# Altium project HAB-Altitude-Dynamics-Control-Card.PrjPcb (part 2 of 4)

## Sheet Controllers.SchDoc: Payload Card Output Control
size A3; Revision: 1A; SheetNumber: 3; SheetTotal: 7; Organization: Brickworks; Address1: Matthew Glazer; Address2: Design Engineer
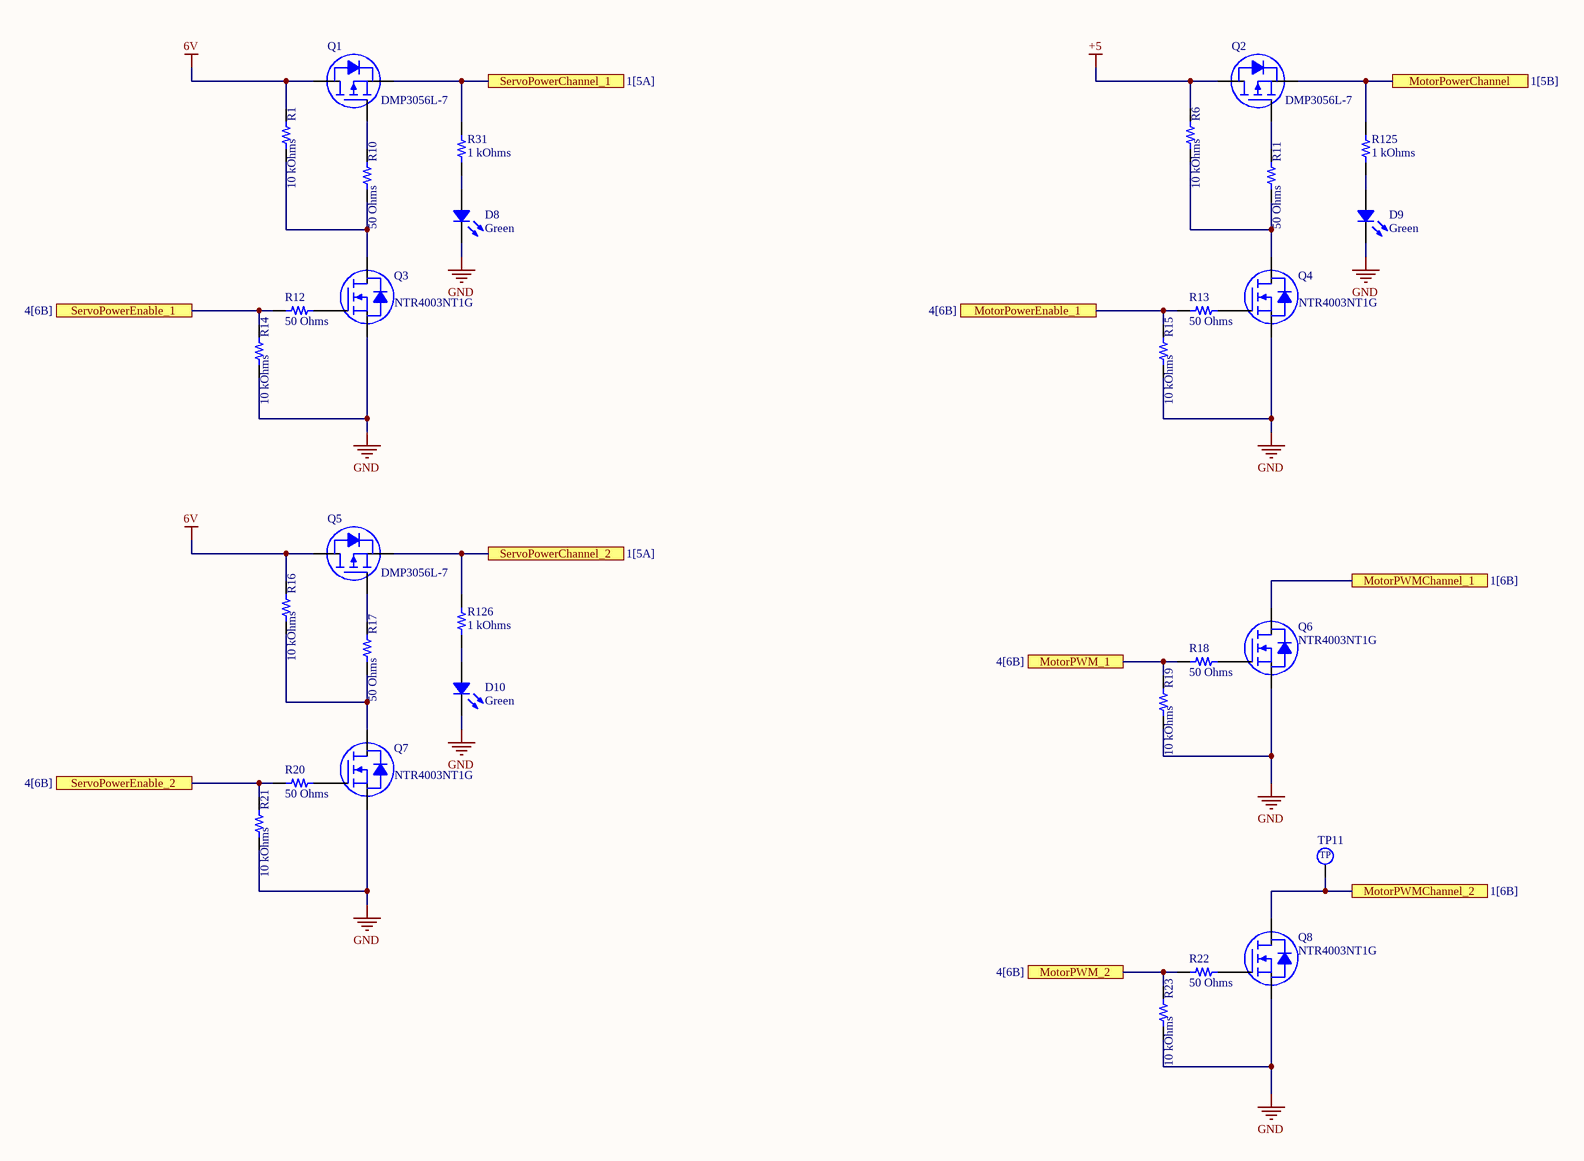
[diagram p2: Controllers.SchDoc]

### Parts
D8  Green  [LED 0603_1608 GREEN]
D9  Green  [LED 0603_1608 GREEN]
D10  Green  [LED 0603_1608 GREEN]
Q1  DMP3056L-7  [DIODES SOT-23-3]
Q2  DMP3056L-7  [DIODES SOT-23-3]
Q3  NTR4003NT1G  [ON SEMI SOT-23-3]
Q4  NTR4003NT1G  [ON SEMI SOT-23-3]
Q5  DMP3056L-7  [DIODES SOT-23-3]
Q6  NTR4003NT1G  [ON SEMI SOT-23-3]
Q7  NTR4003NT1G  [ON SEMI SOT-23-3]
Q8  NTR4003NT1G  [ON SEMI SOT-23-3]
R1  10 kOhms  [RES 0603_1608]
R6  10 kOhms  [RES 0603_1608]
R10  50 Ohms  [RES 0603_1608]
R11  50 Ohms  [RES 0603_1608]
R12  50 Ohms  [RES 0603_1608]
R13  50 Ohms  [RES 0603_1608]
R14  10 kOhms  [RES 0603_1608]
R15  10 kOhms  [RES 0603_1608]
R16  10 kOhms  [RES 0603_1608]
R17  50 Ohms  [RES 0603_1608]
R18  50 Ohms  [RES 0603_1608]
R19  10 kOhms  [RES 0603_1608]
R20  50 Ohms  [RES 0603_1608]
R21  10 kOhms  [RES 0603_1608]
R22  50 Ohms  [RES 0603_1608]
R23  10 kOhms  [RES 0603_1608]
R31  1 kOhms  [RES 0603_1608]
R125  1 kOhms  [RES 0603_1608]
R126  1 kOhms  [RES 0603_1608]
TP11  2.5mm_SMD_TestPoint  [2.5mm TestPoint]  (value not drawn)

### Ports
MotorPowerChannel (see 1[5B]), MotorPowerEnable_1 (see 4[6B]), MotorPWM_1 (see 4[6B]), MotorPWM_2 (see 4[6B]), MotorPWMChannel_1 (see 1[6B]), MotorPWMChannel_2 (see 1[6B]), ServoPowerChannel_1 (see 1[5A]), ServoPowerChannel_2 (see 1[5A]), ServoPowerEnable_1 (see 4[6B]), ServoPowerEnable_2 (see 4[6B])

### Nets
6V: Q1.3(D) Q5.3(D) R1.2 R16.2
+5: Q2.3(D) R6.2
GND: D8.2 D9.2 D10.2 Q3.2(S) Q4.2(S) Q6.2(S) Q7.2(S) Q8.2(S) R14.1 R15.1 R19.1 R21.1 R23.1
NetC1_2: Q1.2(S) R31.2 ; port ServoPowerChannel_1
NetC6_2: Q5.2(S) R126.2 ; port ServoPowerChannel_2
NetC8_2: Q2.2(S) R125.2 ; port MotorPowerChannel
NetD8_1: D8.1 R31.1
NetD9_1: D9.1 R125.1
NetD10_1: D10.1 R126.1
NetJ5_1: Q6.3(D) ; port MotorPWMChannel_1
NetJ6_1: Q8.3(D) TP11.1 ; port MotorPWMChannel_2
NetQ1_1: Q1.1(G) R10.2
NetQ2_1: Q2.1(G) R11.2
NetQ3_1: Q3.1(G) R12.1
NetQ3_3: Q3.3(D) R1.1 R10.1
NetQ4_1: Q4.1(G) R13.1
NetQ4_3: Q4.3(D) R6.1 R11.1
NetQ5_1: Q5.1(G) R17.2
NetQ6_1: Q6.1(G) R18.1
NetQ7_1: Q7.1(G) R20.1
NetQ7_3: Q7.3(D) R16.1 R17.1
NetQ8_1: Q8.1(G) R22.1
NetR12_2: R12.2 R14.2 ; port ServoPowerEnable_1
NetR13_2: R13.2 R15.2 ; port MotorPowerEnable_1
NetR18_2: R18.2 R19.2 ; port MotorPWM_1
NetR20_2: R20.2 R21.2 ; port ServoPowerEnable_2
NetR22_2: R22.2 R23.2 ; port MotorPWM_2

### Notes on the sheet
- Title
- Size:
- Date:
- A3
- Number:
- Time:
- Revision:
- Sheet
- of
- File:
- (in symbol 2.5mm_SMD_TestPoint) TP

### Library data of the parts
D8-D10 = LTST-C193KGKT-5A: LED GREEN CLEAR CHIP SMD; Manufacturer: Lite-On Inc.; Configuration: Standard; Current - Test: 5mA; Lens Color: Colorless; Lens Size: 1.15mm x 0.80mm; Lens Style: Rectangle with Flat Top; Millicandela Rating: 16.25mcd; Viewing Angle: 130°; Voltage - Forward (Vf) (Typ): 2V; Wavelength - Dominant: 572nm; Wavelength - Peak: 574nm; Part Number: LTST-C193KGKT-5A; Color: Green; ComponentLink1Description: Datasheet; ComponentLink1URL: http://optoelectronics.liteon.com/upload/download/DS22-2007-0094/LTST-C193KGKT-5A.PDF; ComponentLink2Description: DigiKey Link; ComponentLink2URL: http://digikey.com/product-detail/en/lite-on-inc/LTST-C193KGKT-5A/160-1828-1-ND/2356247; Device Package: 0603 (1608 Metric); Height (Max): 0.45mm; LastUpdated: 9/2/2020 1:20:41 AM; Lens Transparency: Clear; Lifecycle Status: Active; Minimum Order: 1; Mounting Type: Surface Mount; Package / Case: 0603 (1608 Metric); Packaging: TapeAndReel; PartId: 694; Part Status: Active; Price: 0.06; Series: -; Size / Dimension: 1.60mm L x 0.80mm W; Supplier 1: DigiKey; Supplier Part Number 1: 160-1828-1-ND; Supplier Device Package: Chip LED; Value: Green
Q1 Q2 Q5 = DMP3056L-7: MOSFET P-CH 30V 4.3A SOT23; Manufacturer: Diodes Incorporated; Current - Continuous Drain (Id) @ 25°C: 4.3A (Ta); Drive Voltage (Max Rds On,  Min Rds On): 4.5V, 10V; FET Type: P-Channel; Gate Charge (Qg) (Max) @ Vgs: 11.8nC @ 10V; Input Capacitance (Ciss) (Max) @ Vds: 642pF @ 25V; Power Dissipation (Max): 1.38W (Ta); Rds On (Max) @ Id, Vgs: 50mOhm @ 6A, 10V; Vgs (Max): ±25V; Vgs(th) (Max) @ Id: 2.1V @ 250µA; Part Number: DMP3056L-7; ComponentLink1Description: Datasheet; ComponentLink1URL: https://www.diodes.com/assets/Datasheets/DMP3056L.pdf; ComponentLink2Description: DigiKey Link; ComponentLink2URL: http://digikey.com/product-detail/en/diodes-incorporated/DMP3056L-7/DMP3056L-7DICT-ND/5126873; Drain to Source Voltage (Vdss): 30V; LastUpdated: 9/2/2020 1:25:04 AM; Lifecycle Status: Active; Minimum Order: 1; Mounting Type: Surface Mount; Operating Temperature: -55°C ~ 150°C (TJ); Package / Case: TO-236-3, SC-59, SOT-23-3; Packaging: TapeAndReel; Part Status: Active; Price: 0.11; Series: -; Supplier 1: DigiKey; Supplier Part Number 1: DMP3056L-7DICT-ND; Supplier Device Package: SOT-23; Technology: MOSFET (Metal Oxide)
Q3 Q4 Q6-Q8 = NTR4003NT1G: MOSFET N-CH 30V 500MA SOT-23; Manufacturer: ON Semiconductor; Current - Continuous Drain (Id) @ 25°C: 500mA (Ta); Drive Voltage (Max Rds On,  Min Rds On): 2.5V, 4V; FET Type: N-Channel; Gate Charge (Qg) (Max) @ Vgs: 1.15nC @ 5V; Input Capacitance (Ciss) (Max) @ Vds: 21pF @ 5V; Power Dissipation (Max): 690mW (Ta); Rds On (Max) @ Id, Vgs: 1.5Ohm @ 10mA, 4V; Vgs (Max): ±20V; Vgs(th) (Max) @ Id: 1.4V @ 250µA; Part Number: NTR4003NT1G; ComponentLink1Description: Datasheet; ComponentLink1URL: http://www.onsemi.com/pub/Collateral/NTR4003N-D.PDF; ComponentLink2Description: DigiKey Link; ComponentLink2URL: http://digikey.com/product-detail/en/on-semiconductor/NTR4003NT1G/NTR4003NT1GOSCT-ND/1967270; Drain to Source Voltage (Vdss): 30V; LastUpdated: 9/2/2020 1:25:08 AM; Lifecycle Status: Active; Minimum Order: 1; Mounting Type: Surface Mount; Operating Temperature: -55°C ~ 150°C (TJ); Package / Case: TO-236-3, SC-59, SOT-23-3; Packaging: TapeAndReel; Part Status: Active; Price: 0.05; Series: -; Supplier 1: DigiKey; Supplier Part Number 1: NTR4003NT1GOSCT-ND; Supplier Device Package: SOT-23-3 (TO-236); Technology: MOSFET (Metal Oxide)
R1 R6 R14-R16 R19 R21 R23 = RMCF0603JT10K0: RES 10K OHM 5% 1/10W 0603; Manufacturer: Stackpole Electronics Inc; Power (Watts): 0.1W, 1/10W; Temperature Coefficient: ±200ppm/°C; Part Number: RMCF0603JT10K0; Value: 10 kOhms; ComponentLink1Description: Datasheet; ComponentLink1URL: https://www.seielect.com/catalog/sei-packaging.pdf; ComponentLink2Description: DigiKey Link; ComponentLink2URL: http://digikey.com/product-detail/en/stackpole-electronics-inc/RMCF0603JT10K0/RMCF0603JT10K0CT-ND/1943191; Composition: Thick Film; Device Package: 0603 (1608 Metric); Features: Automotive AEC-Q200; Height - Seated (Max): 0.022" (0.55mm); LastUpdated: 8/30/2020 8:48:45 PM; Lifecycle Status: Active; Minimum Order: 1; Number of Terminations: 2; Operating Temperature: -55°C ~ 155°C; Package / Case: 0603 (1608 Metric); Packaging: CutTape; PartId: 25659; Part Status: Active; Price: 0.10; Ratings: AEC-Q200; Resistance: 10 kOhms; Series: RMCF; Size / Dimension: 0.061" L x 0.031" W (1.55mm x 0.80mm); Supplier 1: DigiKey; Supplier Part Number 1: RMCF0603JT10K0CT-ND; Supplier Device Package: 0603; Tolerance: ±5%
R10-R13 R17 R18 R20 R22 = CRCW060350R0FKEA: RES SMD 50 OHM 1% 1/10W 0603; Manufacturer: Vishay Dale; Power (Watts): 0.1W, 1/10W; Temperature Coefficient: ±100ppm/°C; Part Number: CRCW060350R0FKEA; Value: 50 Ohms; ComponentLink1Description: Datasheet; ComponentLink1URL: http://www.vishay.com/docs/20035/dcrcwe3.pdf; ComponentLink2Description: DigiKey Link; ComponentLink2URL: http://digikey.com/product-detail/en/vishay-dale/CRCW060350R0FKEA/541-3318-1-ND/6684924; Composition: Thick Film; Device Package: 0603 (1608 Metric); Features: Automotive AEC-Q200; Height - Seated (Max): 0.020" (0.50mm); LastUpdated: 9/2/2020 1:09:40 AM; Lifecycle Status: Active; Minimum Order: 1; Number of Terminations: 2; Operating Temperature: -55°C ~ 155°C; Package / Case: 0603 (1608 Metric); Packaging: CutTape; PartId: 23780; Part Status: Active; Price: 0.10; Ratings: AEC-Q200; Resistance: 50 Ohms; Series: CRCW; Size / Dimension: 0.061" L x 0.033" W (1.55mm x 0.85mm); Supplier 1: DigiKey; Supplier Part Number 1: 541-3318-1-ND; Supplier Device Package: 0603; Tolerance: ±1%
R31 R125 R126 = RNCP0603FTD1K00: RES 1K OHM 1% 1/8W 0603; Manufacturer: Stackpole Electronics Inc; Power (Watts): 0.125W, 1/8W; Temperature Coefficient: ±100ppm/°C; Part Number: RNCP0603FTD1K00; Value: 1 kOhms; ComponentLink1Description: Datasheet; ComponentLink1URL: https://www.seielect.com/catalog/sei-rncp.pdf; ComponentLink2Description: DigiKey Link; ComponentLink2URL: http://digikey.com/product-detail/en/stackpole-electronics-inc/RNCP0603FTD1K00/RNCP0603FTD1K00CT-ND/2240445; Composition: Thin Film; Device Package: 0603 (1608 Metric); Features: Anti-Sulfur, Moisture Resistant; Height - Seated (Max): 0.020" (0.50mm); LastUpdated: 9/2/2020 1:10:23 AM; Lifecycle Status: Active; Minimum Order: 1; Number of Terminations: 2; Operating Temperature: -55°C ~ 155°C; Package / Case: 0603 (1608 Metric); Packaging: TapeAndReel; PartId: 5694; Part Status: Active; Price: 0.01; Resistance: 1 kOhms; Series: RNCP; Size / Dimension: 0.059" L x 0.031" W (1.50mm x 0.80mm); Supplier 1: DigiKey; Supplier Part Number 1: RNCP0603FTD1K00CT-ND; Supplier Device Package: 0603; Tolerance: ±1%

## Sheet Microcontroller.SchDoc: Payload Card Microcontroller
size A2; Revision: 1A; SheetNumber: 4; SheetTotal: 7; Organization: Brickworks; Address1: Matthew Glazer; Address2: Design Engineer
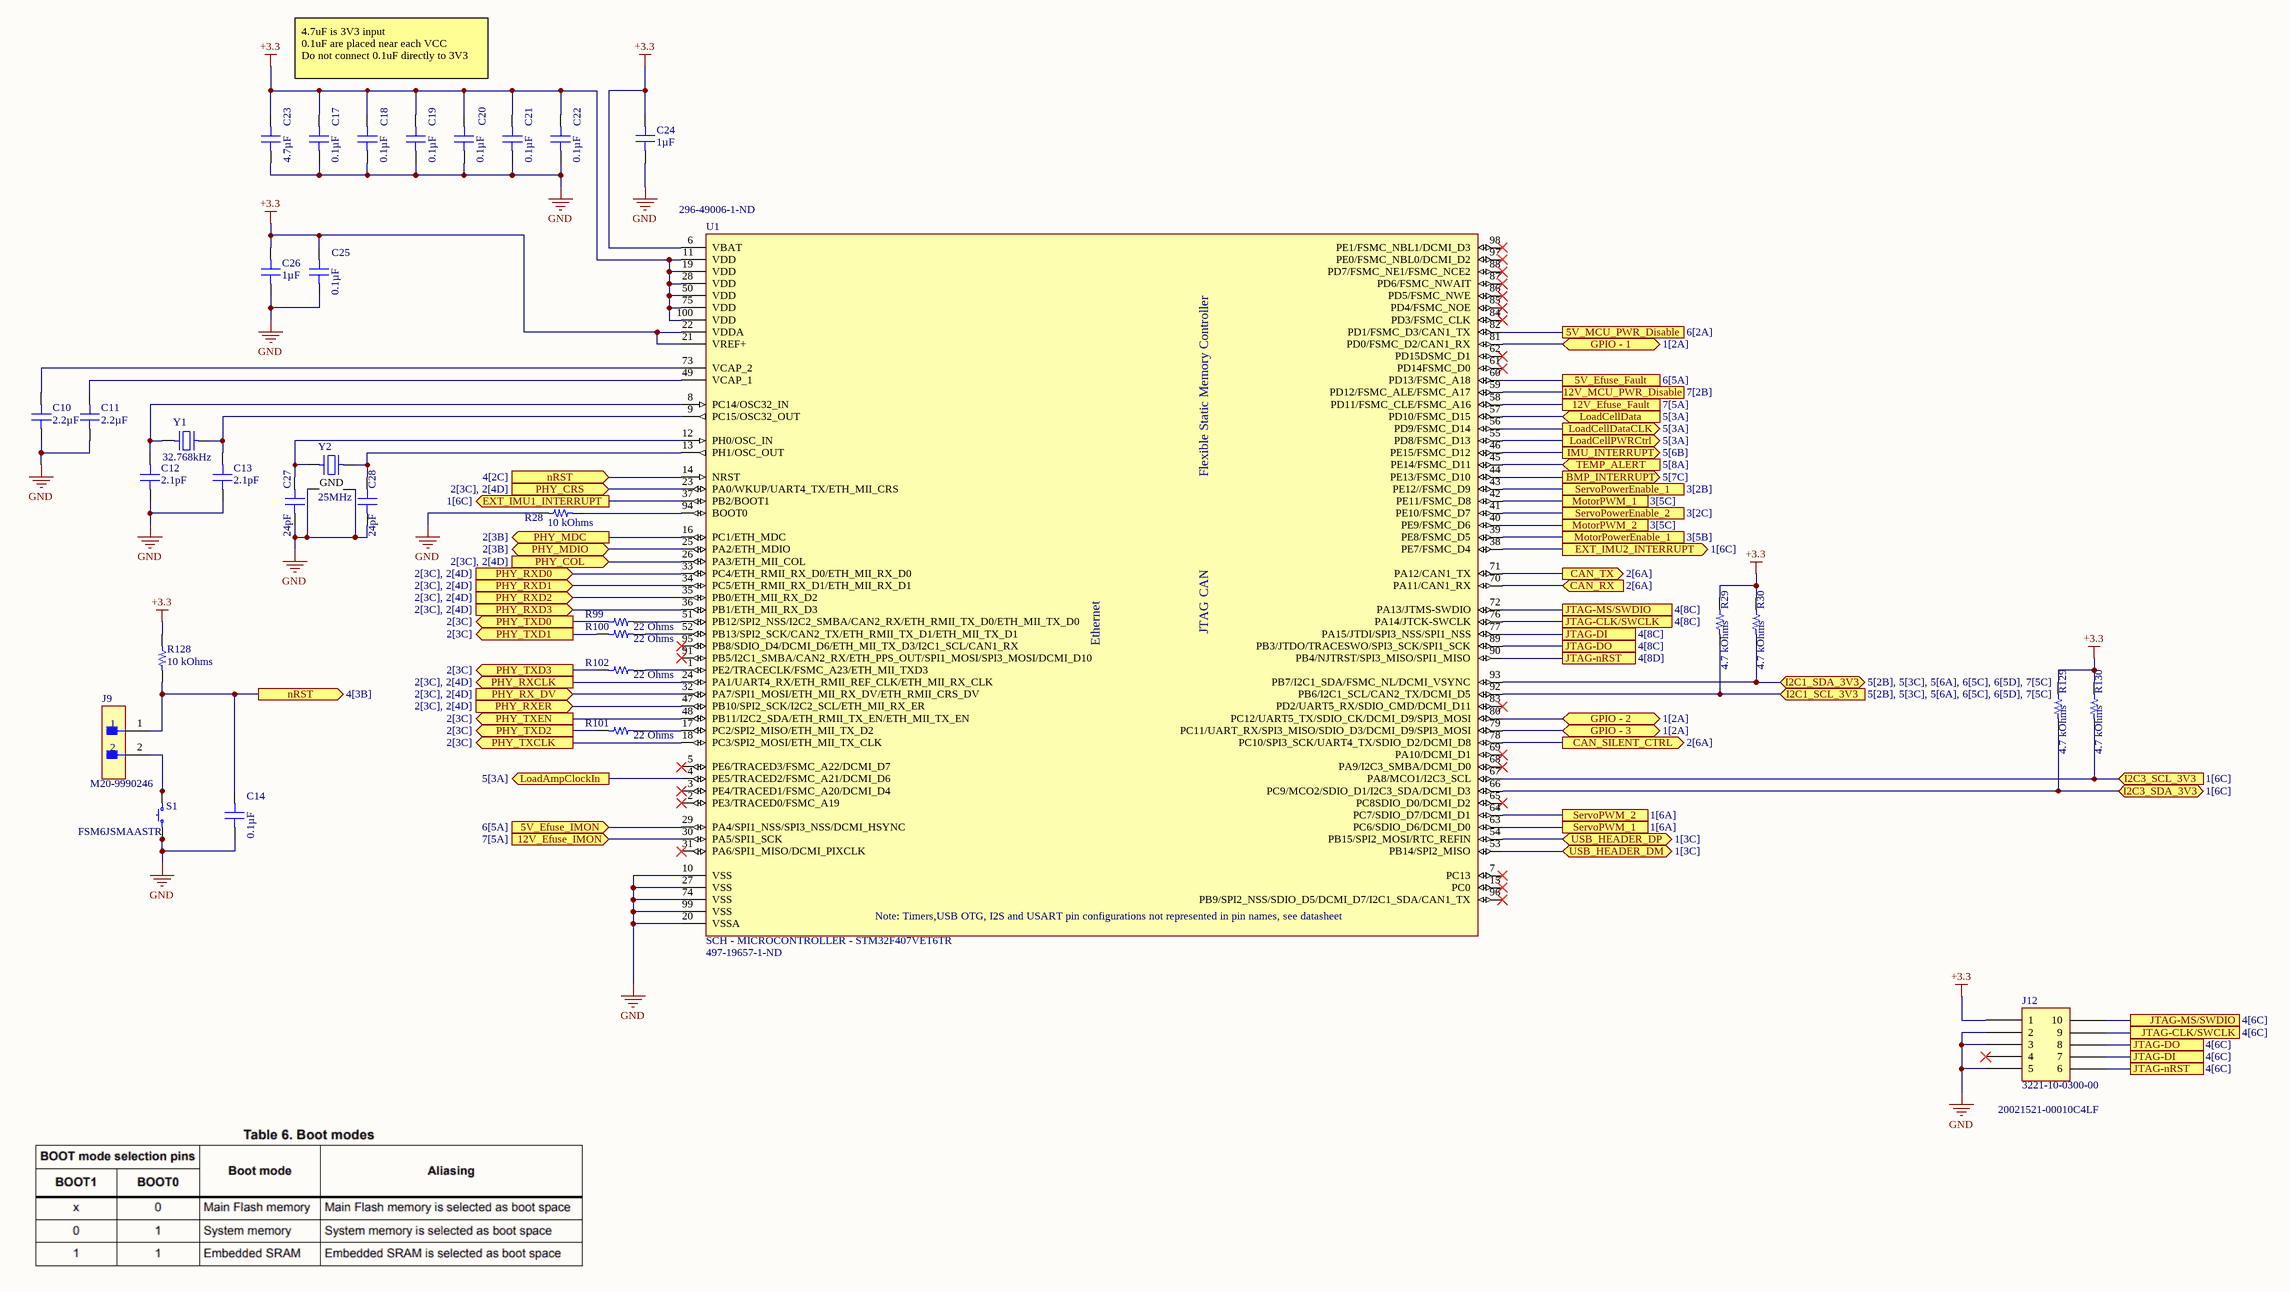
[diagram p3: Microcontroller.SchDoc]

### Parts
C10  2.2µF  [CAP 0603_1608]
C11  2.2µF  [CAP 0603_1608]
C12  2.1pF  [CAP 0603_1608]
C13  2.1pF  [CAP 0603_1608]
C14  0.1µF  [CAP 0603_1608]
C17  0.1µF  [CAP 0603_1608]
C18  0.1µF  [CAP 0603_1608]
C19  0.1µF  [CAP 0603_1608]
C20  0.1µF  [CAP 0603_1608]
C21  0.1µF  [CAP 0603_1608]
C22  0.1µF  [CAP 0603_1608]
C23  4.7µF  [CAP 0603_1608]
C24  1µF  [CAP 0603_1608]
C25  0.1µF  [CAP 0603_1608]
C26  1µF  [CAP 0603_1608]
C27  24pF  [CAP 0603_1608]
C28  24pF  [CAP 0603_1608]
J9  M20-9990246  [FP-M20-9990246-MFG]
J12  3221-10-0300-00  [CNC TECH 3221-10-0300-00]
R28  10 kOhms  [RES 0603_1608]
R29  4.7 kOhms  [RES 0603_1608]
R30  4.7 kOhms  [RES 0603_1608]
R99  22 Ohms  [RES 0603_1608]
R100  22 Ohms  [RES 0603_1608]
R101  22 Ohms  [RES 0603_1608]
R102  22 Ohms  [RES 0603_1608]
R128  10 kOhms  [RES 0603_1608]
R129  4.7 kOhms  [RES 0603_1608]
R130  4.7 kOhms  [RES 0603_1608]
S1  FSM6JSMAASTR  [TE FSM6JSMA]
U1  SCH - MICROCONTROLLER - STM32F407VET6TR  Supplier Part Number 1: 497-19657-1-ND  [PCB - LEADLESS - QFP - ST LQFP-100 14X14MM]
Y1  32.768kHz  [ABRACON ABS07]
Y2  25MHz  [EPSON TSX-3225]

### Ports
5V_Efuse_Fault (see 6[5A]), 5V_Efuse_IMON (in, see 6[5A]), 5V_MCU_PWR_Disable (see 6[2A]), 12V_Efuse_Fault (see 7[5A]), 12V_Efuse_IMON (in, see 7[5A]), 12V_MCU_PWR_Disable (see 7[2B]), BMP_INTERRUPT (out, see 5[7C]), CAN_RX (in, see 2[6A]), CAN_SILENT_CTRL (out, see 2[6A]), CAN_TX (out, see 2[6A]), EXT_IMU1_INTERRUPT (out, see 1[6C]), EXT_IMU2_INTERRUPT (out, see 1[6C]), GPIO - 1 (bidir, see 1[2A]), GPIO - 2 (bidir, see 1[2A]), GPIO - 3 (bidir, see 1[2A]), I2C1_SCL_3V3 (in, see 5[2B], 5[3C], 5[6A], 6[5C], 6[5D], 7[5C]), I2C1_SDA_3V3 (bidir, see 5[2B], 5[3C], 5[6A], 6[5C], 6[5D], 7[5C]), I2C3_SCL_3V3 (in, see 1[6C]), I2C3_SDA_3V3 (bidir, see 1[6C]), IMU_INTERRUPT (out, see 5[6B]), JTAG-CLK/SWCLK (see 4[6C]), JTAG-CLK/SWCLK (see 4[8C]), JTAG-DI (see 4[6C]), JTAG-DI (see 4[8C]), JTAG-DO (see 4[6C]), JTAG-DO (see 4[8C]), JTAG-MS/SWDIO (see 4[6C]), JTAG-MS/SWDIO (see 4[8C]), JTAG-nRST (see 4[6C]), JTAG-nRST (see 4[8D]), LoadAmpClockIn (out, see 5[3A]), LoadCellData (in, see 5[3A]), LoadCellDataCLK (out, see 5[3A]), LoadCellPWRCtrl (out, see 5[3A]), MotorPowerEnable_1 (see 3[5B]), MotorPWM_1 (see 3[5C]), MotorPWM_2 (see 3[5C]), nRST (in, see 4[2C]), nRST (out, see 4[3B]), PHY_COL (in, see 2[3C], 2[4D]), PHY_CRS (in, see 2[3C], 2[4D]), PHY_MDC (out, see 2[3B]), PHY_MDIO (bidir, see 2[3B]), PHY_RX_DV (in, see 2[3C], 2[4D]), PHY_RXCLK (out, see 2[3C], 2[4D]), PHY_RXD0 (in, see 2[3C], 2[4D]), PHY_RXD1 (in, see 2[3C], 2[4D]), PHY_RXD2 (in, see 2[3C], 2[4D]), PHY_RXD3 (in, see 2[3C], 2[4D]), PHY_RXER (in, see 2[3C], 2[4D]), PHY_TXCLK (out, see 2[3C]), PHY_TXD0 (out, see 2[3C]), PHY_TXD1 (out, see 2[3C]), PHY_TXD2 (out, see 2[3C]), PHY_TXD3 (out, see 2[3C]), PHY_TXEN (out, see 2[3C]), ServoPowerEnable_1 (see 3[2B]), ServoPowerEnable_2 (see 3[2C]), ServoPWM_1 (see 1[6A]), ServoPWM_2 (see 1[6A]), TEMP_ALERT (in, see 5[8A]), USB_HEADER_DM (bidir, see 1[3C]), USB_HEADER_DP (bidir, see 1[3C])

### Nets
+3.3: C17.2 C18.2 C19.2 C20.2 C21.2 C22.2 C23.2 C24.2 C25.2 C26.2 J12.1 R29.2 R30.2 R128.1 R129.2 R130.2 U1.6(VBAT) U1.11(VDD) U1.19(VDD) U1.21(VREF+) U1.22(VDDA) U1.28(VDD) U1.50(VDD) U1.75(VDD) U1.100(VDD)
GND: C10.1 C11.1 C12.1 C13.1 C14.1 C17.1 C18.1 C19.1 C20.1 C21.1 C22.1 C23.1 C24.1 C25.1 C26.1 C27.1 C28.1 J12.2 J12.3 J12.5 R28.2 S1.1 S1.2 U1.10(VSS) U1.20(VSSA) U1.27(VSS) U1.74(VSS) U1.99(VSS) Y2.2(GND) Y2.4(GND)
USB_HEADER_N: U1.53(PB14/SPI2_MISO) ; port USB_HEADER_DM
USB_HEADER_P: U1.54(PB15/SPI2_MOSI/RTC_REFIN) ; port USB_HEADER_DP
NetC10_2: C10.2 U1.73(VCAP_2)
NetC11_2: C11.2 U1.49(VCAP_1)
NetC12_2: C12.2 U1.8(PC14/OSC32_IN) Y1.1
NetC13_2: C13.2 U1.9(PC15/OSC32_OUT) Y1.2
NetC14_2: C14.2 J9.1 R128.2 U1.14(NRST) ; port nRST
NetC27_2: C27.2 U1.12(PH0/OSC_IN) Y2.1
NetC28_2: C28.2 U1.13(PH1/OSC_OUT) Y2.3
NetD3_1: U1.82(PD1/FSMC_D3/CAN1_TX) ; port 5V_MCU_PWR_Disable
NetJ1_14: U1.81(PD0/FSMC_D2/CAN1_RX) ; port GPIO - 1
NetJ1_15: U1.80(PC12/UART5_TX/SDIO_CK/DCMI_D9/SPI3_MOSI) ; port GPIO - 2
NetJ1_16: U1.79(PC11/UART_RX/SPI3_MISO/SDIO_D3/DCMI_D9/SPI3_MOSI) ; port GPIO - 3
NetJ3_2: U1.63(PC6/SDIO_D6/DCMI_D0) ; port ServoPWM_1
NetJ4_2: U1.64(PC7/SDIO_D7/DCMI_D1) ; port ServoPWM_2
NetJ8_2: U1.37(PB2/BOOT1) ; port EXT_IMU1_INTERRUPT
NetJ8_3: R129.1 U1.66(PC9/MCO2/SDIO_D1/I2C3_SDA/DCMI_D3) ; port I2C3_SDA_3V3
NetJ8_4: R130.1 U1.67(PA8/MCO1/I2C3_SCL) ; port I2C3_SCL_3V3
NetJ9_2: J9.2 S1.3 S1.4
NetJ11_2: U1.38(PE7/FSMC_D4) ; port EXT_IMU2_INTERRUPT
NetJ12_6: J12.6 U1.90(PB4/NJTRST/SPI3_MISO/SPI1_MISO) ; port JTAG-nRST
NetJ12_7: J12.7 U1.77(PA15/JTDI/SPI3_NSS/SPI1_NSS) ; port JTAG-DI
NetJ12_8: J12.8 U1.89(PB3/JTDO/TRACESWO/SPI3_SCK/SPI1_SCK) ; port JTAG-DO
NetJ12_9: J12.9 U1.76(PA14/JTCK-SWCLK) ; port JTAG-CLK/SWCLK
NetJ12_10: J12.10 U1.72(PA13/JTMS-SWDIO) ; port JTAG-MS/SWDIO
NetR12_2: U1.43(PE12//FSMC_D9) ; port ServoPowerEnable_1
NetR13_2: U1.39(PE8/FSMC_D5) ; port MotorPowerEnable_1
NetR18_2: U1.42(PE11/FSMC_D8) ; port MotorPWM_1
NetR20_2: U1.41(PE10/FSMC_D7) ; port ServoPowerEnable_2
NetR22_2: U1.40(PE9/FSMC_D6) ; port MotorPWM_2
NetR28_1: R28.1 U1.94(BOOT0)
NetR29_1: R29.1 U1.92(PB6/I2C1_SCL/CAN2_TX/DCMI_D5) ; port I2C1_SCL_3V3
NetR30_1: R30.1 U1.93(PB7/I2C1_SDA/FSMC_NL/DCMI_VSYNC) ; port I2C1_SDA_3V3
NetR37_1: U1.60(PD13/FSMC_A18) ; port 5V_Efuse_Fault
NetR44_2: U1.29(PA4/SPI1_NSS/SPI3_NSS/DCMI_HSYNC) ; port 5V_Efuse_IMON
NetR57_2: U1.4(PE5/TRACED2/FSMC_A21/DCMI_D6) ; port LoadAmpClockIn
NetR74_1: U1.58(PD11/FSMC_CLE/FSMC_A16) ; port 12V_Efuse_Fault
NetR80_2: U1.30(PA5/SPI1_SCK) ; port 12V_Efuse_IMON
NetR83_2: U1.59(PD12/FSMC_ALE/FSMC_A17) ; port 12V_MCU_PWR_Disable
NetR91_2: U1.78(PC10/SPI3_SCK/UART4_TX/SDIO_D2/DCMI_D8) ; port CAN_SILENT_CTRL
NetR94_1: U1.25(PA2/ETH_MDIO) ; port PHY_MDIO
NetR98_1: U1.18(PC3/SPI2_MOSI/ETH_MII_TX_CLK) ; port PHY_TXCLK
NetR99_1: R99.1 ; port PHY_TXD0
NetR99_2: R99.2 U1.51(PB12/SPI2_NSS/I2C2_SMBA/CAN2_RX/ETH_RMII_TX_D0/ETH_MII_TX_D0)
NetR100_1: R100.1 ; port PHY_TXD1
NetR100_2: R100.2 U1.52(PB13/SPI2_SCK/CAN2_TX/ETH_RMII_TX_D1/ETH_MII_TX_D1)
NetR101_1: R101.1 ; port PHY_TXD2
NetR101_2: R101.2 U1.17(PC2/SPI2_MISO/ETH_MII_TX_D2)
NetR102_1: R102.1 ; port PHY_TXD3
NetR102_2: R102.2 U1.1(PE2/TRACECLK/FSMC_A23/ETH_MII_TXD3)
NetR103_1: U1.48(PB11/I2C2_SDA/ETH_RMII_TX_EN/ETH_MII_TX_EN) ; port PHY_TXEN
NetR104_1: U1.24(PA1/UART4_RX/ETH_RMII_REF_CLK/ETH_MII_RX_CLK) ; port PHY_RXCLK
NetR105_1: U1.33(PC4/ETH_RMII_RX_D0/ETH_MII_RX_D0) ; port PHY_RXD0
NetR106_1: U1.34(PC5/ETH_RMII_RX_D1/ETH_MII_RX_D1) ; port PHY_RXD1
NetR107_1: U1.35(PB0/ETH_MII_RX_D2) ; port PHY_RXD2
NetR108_1: U1.36(PB1/ETH_MII_RX_D3) ; port PHY_RXD3
NetR111_1: U1.47(PB10/SPI2_SCK/I2C2_SCL/ETH_MII_RX_ER) ; port PHY_RXER
NetR112_1: U1.32(PA7/SPI1_MOSI/ETH_MII_RX_DV/ETH_RMII_CRS_DV) ; port PHY_RX_DV
NetR114_1: U1.23(PA0/WKUP/UART4_TX/ETH_MII_CRS) ; port PHY_CRS
NetR115_1: U1.26(PA3/ETH_MII_COL) ; port PHY_COL
NetU1_16: U1.16(PC1/ETH_MDC) ; port PHY_MDC
NetU1_44: U1.44(PE13/FSMC_D10) ; port BMP_INTERRUPT
NetU1_45: U1.45(PE14/FSMC_D11) ; port TEMP_ALERT
NetU1_46: U1.46(PE15/FSMC_D12) ; port IMU_INTERRUPT
NetU1_55: U1.55(PD8/FSMC_D13) ; port LoadCellPWRCtrl
NetU1_56: U1.56(PD9/FSMC_D14) ; port LoadCellDataCLK
NetU1_57: U1.57(PD10/FSMC_D15) ; port LoadCellData
NetU1_70: U1.70(PA11/CAN1_RX) ; port CAN_RX
NetU1_71: U1.71(PA12/CAN1_TX) ; port CAN_TX

Not connected (* = marked no-connect by the designer): J12 4*; U1 2(PE3/TRACED0/FSMC_A19)* 3(PE4/TRACED1/FSMC_A20/DCMI_D4)* 5(PE6/TRACED3/FSMC_A22/DCMI_D7)* 7(PC13)* 15(PC0)* 31(PA6/SPI1_MISO/DCMI_PIXCLK)* 61(PD14FSMC_D0)* 62(PD15DSMC_D1)* 65(PC8SDIO_D0/DCMI_D2)* 68(PA9/I2C3_SMBA/DCMI_D0)* 69(PA10/DCMI_D1)* 83(PD2/UART5_RX/SDIO_CMD/DCMI_D11)* 84(PD3/FSMC_CLK)* 85(PD4/FSMC_NOE)* 86(PD5/FSMC_NWE)* 87(PD6/FSMC_NWAIT)* 88(PD7/FSMC_NE1/FSMC_NCE2)* 91(PB5/I2C1_SMBA/CAN2_RX/ETH_PPS_OUT/SPI1_MOSI/SPI3_MOSI/DCMI_D10)* 95(PB8/SDIO_D4/DCMI_D6/ETH_MII_TX_D3/I2C1_SCL/CAN1_RX)* 96(PB9/SPI2_NSS/SDIO_D5/DCMI_D7/I2C1_SDA/CAN1_TX)* 97(PE0/FSMC_NBL0/DCMI_D2)* 98(PE1/FSMC_NBL1/DCMI_D3)*

### Notes on the sheet
- 4.7uF is 3V3 input
  0.1uF are placed near each VCC
  Do not connect 0.1uF directly to 3V3
- (near J12) 20021521-00010C4LF
- Title
- Size:
- Date:
- File:
- A2
- Number:
- Time:
- Revision:
- Sheet
- of
- (in symbol SCH - MICROCONTROLLER - STM32F407VET6TR) Flexible Static Memory Controller; CAN; JTAG; Ethernet; Note: Timers,USB OTG, I2S and USART pin configurations not represented in pin names, see datasheet

### Library data of the parts
C10 C11 = EMK107BJ225KA-T: CAP CER 2.2UF 16V X5R 0603; Manufacturer: Taiyo Yuden; Tolerance: ±10%; Part Number: EMK107BJ225KA-T; Value: 2.2µF; Applications: General Purpose; Capacitance: 2.2µF; ComponentLink1Description: Datasheet; ComponentLink1URL: https://ds.yuden.co.jp/TYCOMPAS/ut/detail?pn=EMK107BJ225KA-T  &u=M; ComponentLink2Description: DigiKey Link; ComponentLink2URL: http://digikey.com/product-detail/en/taiyo-yuden/EMK107BJ225KA-T/587-1430-1-ND/1004061; Device Package: 0603 (1608 Metric); LastUpdated: 9/2/2020 1:03:30 AM; Lifecycle Status: Active; Minimum Order: 1; Mounting Type: Surface Mount, MLCC; Operating Temperature: -55°C ~ 85°C; Package / Case: 0603 (1608 Metric); Packaging: TapeAndReel; PartId: 5619; Part Status: Active; Price: 0.02; Series: M; Size / Dimension: 0.063" L x 0.031" W (1.60mm x 0.80mm); Supplier 1: DigiKey; Supplier Part Number 1: 587-1430-1-ND; Temperature Coefficient: X5R; Thickness (Max): 0.035" (0.90mm); Voltage - Rated: 16V
C12 C13 = CBR06C219B5GAC: CAP CER RF 2.1PF 50V +/-0.1 PF C; Manufacturer: KEMET; Temperature Coefficient: C0G, NP0; Tolerance: ±0.1pF; Part Number: CBR06C219B5GAC; Value: 2.1pF; Applications: RF, Microwave, High Frequency; Capacitance: 2.1pF; ComponentLink1Description: Datasheet; ComponentLink1URL: https://api.kemet.com/component-edge/download/datasheet/CBR06C219B5GAC.pdf; ComponentLink2Description: DigiKey Link; ComponentLink2URL: http://digikey.com/product-detail/en/kemet/CBR06C219B5GAC/399-16153-1-ND/7649738; Device Package: 0603 (1608 Metric); Features: High Q, Low Loss, Ultra Low ESR; LastUpdated: 9/2/2020 1:03:15 AM; Lifecycle Status: Active; Minimum Order: 1; Mounting Type: Surface Mount, MLCC; Operating Temperature: -55°C ~ 125°C; Package / Case: 0603 (1608 Metric); Packaging: TapeAndReel; PartId: 13663; Part Status: Active; Price: 0.05; Series: CBR-SMD RF C0G; Size / Dimension: 0.063" L x 0.031" W (1.60mm x 0.80mm); Supplier 1: DigiKey; Supplier Part Number 1: 399-16153-1-ND; Thickness (Max): 0.034" (0.87mm); Voltage - Rated: 50V
C14 C17-C22 C25 = CL10B104KA8WPNC: CAP CER 0.1UF 25V X7R 0603; Manufacturer: Samsung Electro-Mechanics; Tolerance: ±10%; Part Number: CL10B104KA8WPNC; Value: 0.1µF; Applications: Automotive; Capacitance: 0.1µF; ComponentLink1Description: Datasheet; ComponentLink1URL: http://www.samsungsem.com/kr/support/product-search/mlcc/CL10B104KA8WPNC.jsp; ComponentLink2Description: DigiKey Link; ComponentLink2URL: http://digikey.com/product-detail/en/samsung-electro-mechanics/CL10B104KA8WPNC/1276-6717-1-ND/5961576; Device Package: 0603 (1608 Metric); Features: Open Mode; LastUpdated: 9/2/2020 1:03:30 AM; Lifecycle Status: Active; Minimum Order: 1; Mounting Type: Surface Mount, MLCC; Operating Temperature: -55°C ~ 125°C; Package / Case: 0603 (1608 Metric); Packaging: TapeAndReel; PartId: 5631; Part Status: Active; Price: 0.02; Ratings: AEC-Q200; Series: CL; Size / Dimension: 0.063" L x 0.031" W (1.60mm x 0.80mm); Supplier 1: DigiKey; Supplier Part Number 1: 1276-6717-1-ND; Temperature Coefficient: X7R; Thickness (Max): 0.035" (0.90mm); Voltage - Rated: 25V
C23 = C1608X5R1C475K080AC: CAP CER 4.7UF 16V X5R 0603; Manufacturer: TDK Corporation; Tolerance: ±10%; Part Number: C1608X5R1C475K080AC; Value: 4.7µF; Applications: General Purpose; Capacitance: 4.7µF; ComponentLink1Description: Datasheet; ComponentLink1URL: https://product.tdk.com/info/en/catalog/datasheets/mlcc_commercial_general_en.pdf?ref_disty=digikey; ComponentLink2Description: DigiKey Link; ComponentLink2URL: http://digikey.com/product-detail/en/tdk-corporation/C1608X5R1C475K080AC/445-7478-1-ND/2733550; Device Package: 0603 (1608 Metric); Features: Low ESL; LastUpdated: 9/2/2020 1:03:17 AM; Lifecycle Status: Active; Minimum Order: 1; Mounting Type: Surface Mount, MLCC; Operating Temperature: -55°C ~ 85°C; Package / Case: 0603 (1608 Metric); Packaging: TapeAndReel; PartId: 12901; Part Status: Active; Price: 0.06; Series: C; Size / Dimension: 0.063" L x 0.031" W (1.60mm x 0.80mm); Supplier 1: DigiKey; Supplier Part Number 1: 445-7478-1-ND; Temperature Coefficient: X5R; Thickness (Max): 0.035" (0.90mm); Voltage - Rated: 16V
C24 C26 = GCM188R71C105KA64J: CAP CER 1UF 16V X7R 0603; Manufacturer: Murata Electronics; Tolerance: ±10%; Part Number: GCM188R71C105KA64J; Value: 1µF; Applications: Automotive; Capacitance: 1µF; ComponentLink1Description: Datasheet; ComponentLink1URL: https://www.murata.com/~/media/webrenewal/support/library/catalog/products/capacitor/mlcc/c03e.ashx?la=en-us; ComponentLink2Description: DigiKey Link; ComponentLink2URL: http://digikey.com/product-detail/en/murata-electronics/GCM188R71C105KA64J/490-12657-1-ND/5797626; Device Package: 0603 (1608 Metric); LastUpdated: 9/2/2020 1:03:14 AM; Lifecycle Status: Active; Minimum Order: 1; Mounting Type: Surface Mount, MLCC; Operating Temperature: -55°C ~ 125°C; Package / Case: 0603 (1608 Metric); Packaging: TapeAndReel; PartId: 13992; Part Status: Active; Price: 0.03; Ratings: AEC-Q200; Series: GCM; Size / Dimension: 0.063" L x 0.031" W (1.60mm x 0.80mm); Supplier 1: DigiKey; Supplier Part Number 1: 490-12657-1-ND; Temperature Coefficient: X7R; Thickness (Max): 0.035" (0.90mm); Voltage - Rated: 16V
C27 C28 = CL10C240JB8NNNC: CAP CER 24PF 50V C0G/NP0 0603; Manufacturer: Samsung Electro-Mechanics; Temperature Coefficient: C0G, NP0; Tolerance: ±5%; Part Number: CL10C240JB8NNNC; Value: 24pF; Applications: General Purpose; Capacitance: 24pF; ComponentLink1Description: Datasheet; ComponentLink1URL: http://www.samsungsem.com/kr/support/product-search/mlcc/CL10C240JB8NNNC.jsp; ComponentLink2Description: DigiKey Link; ComponentLink2URL: http://digikey.com/product-detail/en/samsung-electro-mechanics/CL10C240JB8NNNC/1276-1761-1-ND/3889847; Device Package: 0603 (1608 Metric); LastUpdated: 9/2/2020 1:03:22 AM; Lifecycle Status: Active; Minimum Order: 1; Mounting Type: Surface Mount, MLCC; Operating Temperature: -55°C ~ 125°C; Package / Case: 0603 (1608 Metric); Packaging: TapeAndReel; PartId: 10003; Part Status: Active; Price: 0.01; Series: CL; Size / Dimension: 0.063" L x 0.031" W (1.60mm x 0.80mm); Supplier 1: DigiKey; Supplier Part Number 1: 1276-1761-1-ND; Thickness (Max): 0.035" (0.90mm); Voltage - Rated: 50V
J9 = CMP-15831-000009-1: CONN HEADER VERT 2POS 2.54MM; Manufacturer: Harwin; Conn Gender: Male; Conn Orientation: Vertical; Number Of Contacts: 2; Current Rating: 3A; ComponentLink2URL: https://cdn.harwin.com/pdfs/M20-999.pdf; ComponentLink2Description: Datasheet; Package: M20-9990246; Temperature: -40°C to +105°C; Octopart: https://octopart.com/m20-9990246-harwin-2590635; Mouser Description: 2.54mm (0.1") Pitch SIL Vertical PC Tail Pin Header, 6.1mm mating pin height, tin, 2 contacts; Temperature Range High: +105°C; Device Class L1: Connectors; RoHS: TRUE; Automotive: No; Height: 8.99mm; Number Of Rows: 1; Contact Material: Tin,Nickel; Category: Conn; Pitch: 2.54mm; Lead Free: Yes; Digikey Description: CONN HEADER VERT 2POS 2.54MM; Manufacturer Part Number: M20-9990246; Temperature Range Low: -40°C; Device Class L3: unset; Device Class L2: Headers and Wire Housings
J12 = 3221-10-0300-00: CONN HEADER SMD 10POS 1.27MM; Manufacturer: CNC Tech; Current Rating (Amps): 1A; Material Flammability Rating: UL94 V-0; Number of Positions: 10; Number of Positions Loaded: All; Pitch - Mating: 0.050" (1.27mm); Shrouding: Shrouded - 4 Wall; Style: Board to Cable/Wire; Part Number: 3221-10-0300-00; ComponentLink1Description: Datasheet; ComponentLink1URL: http://cnctech.us/idcmatching2.pdf; ComponentLink2Description: DigiKey Link; ComponentLink2URL: http://digikey.com/product-detail/en/cnc-tech/3221-10-0300-00/1175-1735-ND/4878946; Connector Type: Header; Contact Finish - Mating: Gold; Contact Finish - Post: Gold; Contact Finish Thickness - Mating: Flash; Contact Material: Brass; Contact Shape: Square; Contact Type: Male Pin; Fastening Type: Push-Pull; Features: Keying Slot; Insulation Height: 0.213" (5.40mm); Insulation Material: Polyamide (PA6T), Nylon 6T; LastUpdated: 1/13/2020 12:09:21 AM; Lifecycle Status: Active; Minimum Order: 1; Mounting Type: Surface Mount; Number of Rows: 2; Operating Temperature: -40°C ~ 105°C; Packaging: Tray; PartId: 109; Part Status: Active; Price: 0.73; Row Spacing - Mating: 0.050" (1.27mm); Series: -; Supplier 1: DigiKey; Supplier Part Number 1: 1175-1735-ND; Termination: Solder
R28 R128 = RMCF0603JT10K0: as R1 on sheet Controllers; Part Number: RMCF0603JT10K0; Value: 10 kOhms; ComponentLink1Description: Datasheet; ComponentLink1URL: https://www.seielect.com/catalog/sei-packaging.pdf; ComponentLink2Description: DigiKey Link; ComponentLink2URL: http://digikey.com/product-detail/en/stackpole-electronics-inc/RMCF0603JT10K0/RMCF0603JT10K0CT-ND/1943191; Composition: Thick Film; Device Package: 0603 (1608 Metric); Features: Automotive AEC-Q200; Height - Seated (Max): 0.022" (0.55mm); LastUpdated: 8/30/2020 8:48:45 PM; Lifecycle Status: Active; Minimum Order: 1; Number of Terminations: 2; Operating Temperature: -55°C ~ 155°C; Package / Case: 0603 (1608 Metric); Packaging: CutTape; PartId: 25659; Part Status: Active; Price: 0.10; Ratings: AEC-Q200; Resistance: 10 kOhms; Series: RMCF; Size / Dimension: 0.061" L x 0.031" W (1.55mm x 0.80mm); Supplier 1: DigiKey; Supplier Part Number 1: RMCF0603JT10K0CT-ND; Supplier Device Package: 0603; Tolerance: ±5%
R29 R30 R129 R130 = RMCF0603FT4K70: RES 4.7K OHM 1% 1/10W 0603; Manufacturer: Stackpole Electronics Inc; Power (Watts): 0.1W, 1/10W; Temperature Coefficient: ±100ppm/°C; Part Number: RMCF0603FT4K70; Value: 4.7 kOhms; ComponentLink1Description: Datasheet; ComponentLink1URL: https://www.seielect.com/catalog/sei-rmcf_rmcp.pdf; ComponentLink2Description: DigiKey Link; ComponentLink2URL: http://digikey.com/product-detail/en/stackpole-electronics-inc/RMCF0603FT4K70/RMCF0603FT4K70CT-ND/1943033; Composition: Thick Film; Device Package: 0603 (1608 Metric); Features: Automotive AEC-Q200; Height - Seated (Max): 0.022" (0.55mm); LastUpdated: 9/2/2020 1:10:22 AM; Lifecycle Status: Active; Minimum Order: 1; Number of Terminations: 2; Operating Temperature: -55°C ~ 155°C; Package / Case: 0603 (1608 Metric); Packaging: CutTape; PartId: 6078; Part Status: Active; Price: 0.10; Ratings: AEC-Q200; Resistance: 4.7 kOhms; Series: RMCF; Size / Dimension: 0.061" L x 0.031" W (1.55mm x 0.80mm); Supplier 1: DigiKey; Supplier Part Number 1: RMCF0603FT4K70CT-ND; Supplier Device Package: 0603; Tolerance: ±1%
R99-R102 = RMCF0603FT22R0: RES 22 OHM 1% 1/10W 0603; Manufacturer: Stackpole Electronics Inc; Power (Watts): 0.1W, 1/10W; Temperature Coefficient: ±100ppm/°C; Part Number: RMCF0603FT22R0; Value: 22 Ohms; ComponentLink1Description: Datasheet; ComponentLink1URL: https://www.seielect.com/catalog/sei-packaging.pdf; ComponentLink2Description: DigiKey Link; ComponentLink2URL: http://digikey.com/product-detail/en/stackpole-electronics-inc/RMCF0603FT22R0/RMCF0603FT22R0CT-ND/1942946; Composition: Thick Film; Device Package: 0603 (1608 Metric); Features: Automotive AEC-Q200; Height - Seated (Max): 0.022" (0.55mm); LastUpdated: 9/2/2020 1:10:13 AM; Lifecycle Status: Active; Minimum Order: 1; Number of Terminations: 2; Operating Temperature: -55°C ~ 155°C; Package / Case: 0603 (1608 Metric); Packaging: CutTape; PartId: 10611; Part Status: Active; Price: 0.10; Ratings: AEC-Q200; Resistance: 22 Ohms; Series: RMCF; Size / Dimension: 0.061" L x 0.031" W (1.55mm x 0.80mm); Supplier 1: DigiKey; Supplier Part Number 1: RMCF0603FT22R0CT-ND; Supplier Device Package: 0603; Tolerance: ±1%
S1 = FSM6JSMAASTR: SWITCH TACTILE SPST-NO 0.05A 24V; Manufacturer: TE Connectivity ALCOSWITCH Switches; Actuator Height off PCB, Vertical: 7.00mm; Actuator Orientation: Top Actuated; Actuator Type: Standard; Contact Rating @ Voltage: 0.05A @ 24VDC; Illumination: Non-Illuminated; Operating Force: 260gf; Outline: 6.00mm x 6.00mm; Switch Function: Off-Mom; Part Number: FSM6JSMAASTR; Circuit: SPST-NO; ComponentLink1Description: Datasheet; ComponentLink1URL: https://www.te.com/commerce/DocumentDelivery/DDEController?Action=srchrtrv&DocNm=1308111-1_SWITCHES_CORE_PROGRAM_CATALOG&DocType=CS&DocLang=English; ComponentLink2Description: DigiKey Link; ComponentLink2URL: http://digikey.com/product-detail/en/te-connectivity-alcoswitch-switches/FSM6JSMAASTR/450-2138-1-ND/5343818; LastUpdated: 9/2/2020 1:27:08 AM; Lifecycle Status: Active; Minimum Order: 1; Mounting Type: Surface Mount; Operating Temperature: -40°C ~ 105°C; Packaging: TapeAndReel; Part Status: Active; Price: 0.37; Series: FSMJSMA; Supplier 1: DigiKey; Supplier Part Number 1: 450-2138-1-ND; Termination Style: Gull Wing
Y1 = ABS07-166-32.768KHZ-T: IOT 32.786KHZ XTAL; Manufacturer: Abracon LLC; ESR (Equivalent Series Resistance): 70 kOhms; Frequency Tolerance: ±10ppm; Load Capacitance: 7pF; Operating Mode: Fundamental; Part Number: ABS07-166-32.768KHZ-T; ComponentLink1Description: Datasheet; ComponentLink1URL: https://abracon.com/datasheets/ABS07-166-32.768kHz-T.pdf; ComponentLink2Description: DigiKey Link; ComponentLink2URL: http://digikey.com/product-detail/en/abracon-llc/ABS07-166-32.768KHZ-T/535-14514-1-ND/8827205; Frequency: 32.768kHz; Height - Seated (Max): 0.035" (0.90mm); LastUpdated: 9/2/2020 1:21:47 AM; Lifecycle Status: Active; Minimum Order: 1; Mounting Type: Surface Mount; Operating Temperature: -40°C ~ 85°C; Package / Case: 2-SMD, No Lead; Packaging: TapeAndReel; PartId: 384; Part Status: Active; Price: 0.35; Series: ABS07; Size / Dimension: 0.126" L x 0.059" W (3.20mm x 1.50mm); Supplier 1: DigiKey; Supplier Part Number 1: 535-14514-1-ND; Type: kHz Crystal (Tuning Fork); Value: 32.768kHz
Y2 = TSX-3225 25.0000MF20P-C0: CRYSTAL 25.0000MHZ 18PF SMD; Manufacturer: EPSON; ESR (Equivalent Series Resistance): 40 Ohms; Frequency Stability: ±20ppm; Frequency Tolerance: ±10ppm; Operating Mode: Fundamental; Part Number: TSX-3225 25.0000MF20P-C0; ComponentLink1Description: Datasheet; ComponentLink1URL: https://support.epson.biz/td/api/doc_check.php?dl=brief_TSX-3225&lang=en; ComponentLink2Description: DigiKey Link; ComponentLink2URL: http://digikey.com/product-detail/en/epson/TSX-3225-25.0000MF20P-C0/SER4212CT-ND/7430967; Frequency: 25MHz; Height - Seated (Max): 0.024" (0.60mm); LastUpdated: 9/2/2020 1:21:54 AM; Lifecycle Status: Active; Load Capacitance: 18pF; Minimum Order: 1; Mounting Type: Surface Mount; Operating Temperature: -20°C ~ 85°C; Package / Case: 4-SMD, No Lead; Packaging: TapeAndReel; PartId: 447; Part Status: Active; Price: 0.18; Series: TSX-3225; Size / Dimension: 0.126" L x 0.098" W (3.20mm x 2.50mm); Supplier 1: DigiKey; Supplier Part Number 1: SER4212CT-ND; Type: MHz Crystal; Value: 25MHz
U1 = SCH - MICROCONTROLLER - STM32F407VET6TR: Supplier 1: Digi-Key

## Sheet Sensors.SchDoc: Payload Card Sensors
size A3; Revision: 1A; SheetNumber: 5; SheetTotal: 7; Organization: Brickworks; Address1: Matthew Glazer; Address2: Design Engineer
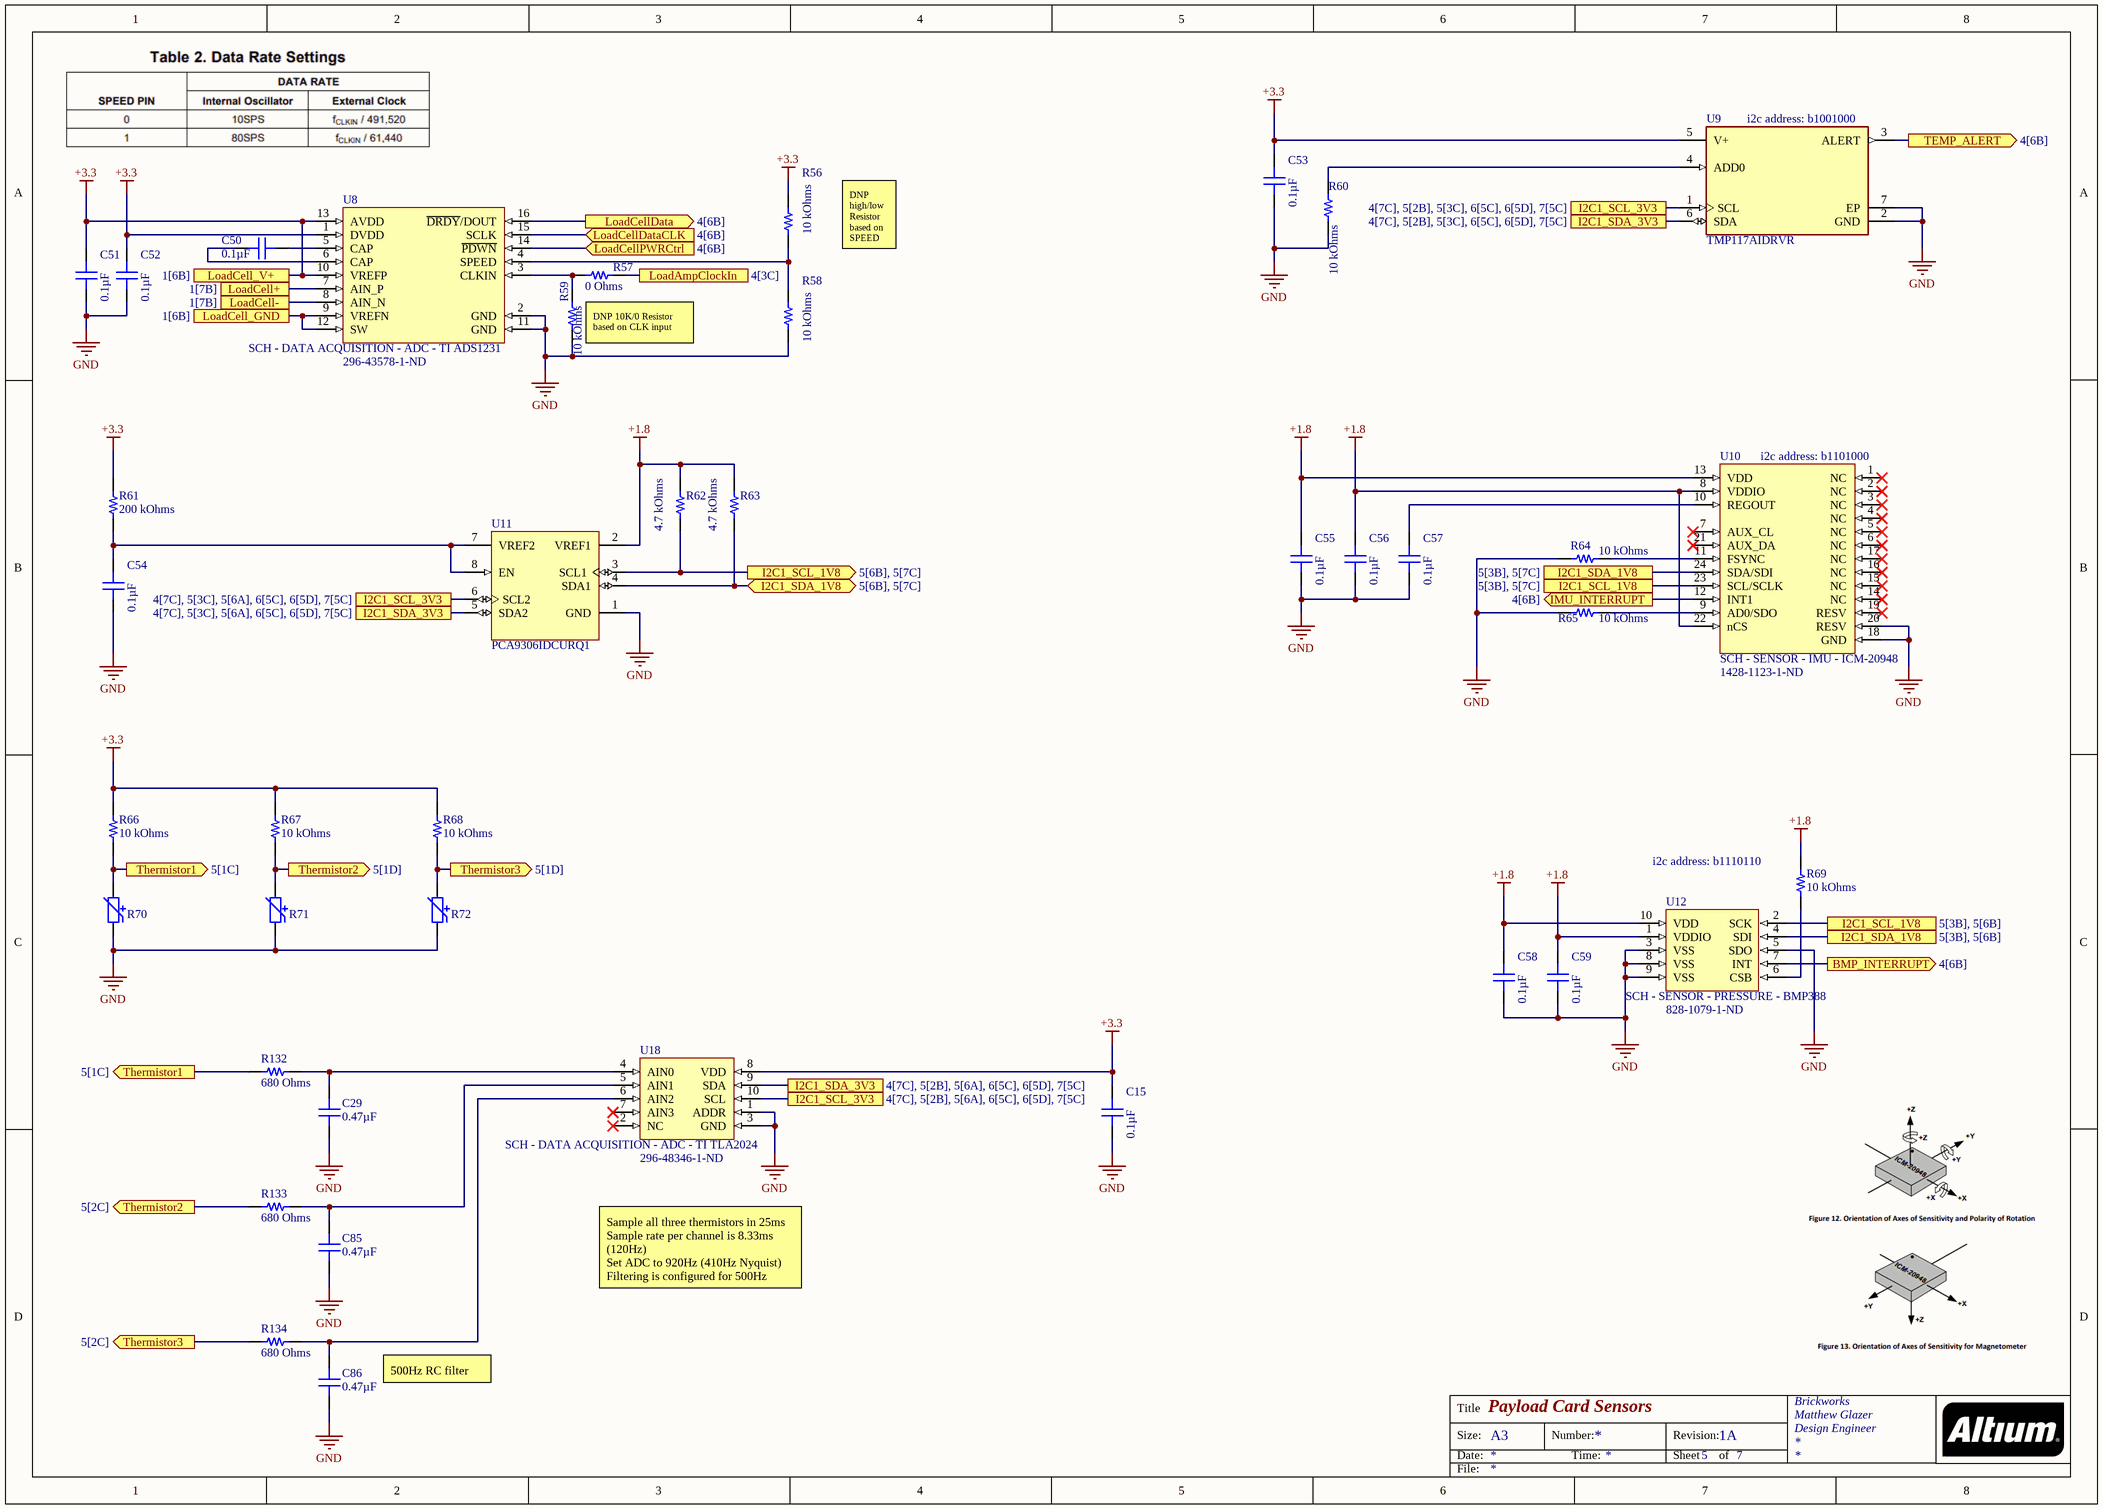
[diagram p4: Sensors.SchDoc]

### Parts
C15  0.1µF  [CAP 0603_1608]
C29  0.47µF  [CAP 0603_1608]
C50  0.1µF  [CAP 0603_1608]
C51  0.1µF  [CAP 0603_1608]
C52  0.1µF  [CAP 0603_1608]
C53  0.1µF  [CAP 0603_1608]
C54  0.1µF  [CAP 0603_1608]
C55  0.1µF  [CAP 0603_1608]
C56  0.1µF  [CAP 0603_1608]
C57  0.1µF  [CAP 0603_1608]
C58  0.1µF  [CAP 0603_1608]
C59  0.1µF  [CAP 0603_1608]
C85  0.47µF  [CAP 0603_1608]
C86  0.47µF  [CAP 0603_1608]
R56  10 kOhms  [RES 0603_1608]
R57  0 Ohms  [RES 0603_1608]
R58  10 kOhms  [RES 0603_1608]
R59  10 kOhms  [RES 0603_1608]
R60  10 kOhms  [RES 0603_1608]
R61  200 kOhms  [RES 0603_1608]
R62  4.7 kOhms  [RES 0603_1608]
R63  4.7 kOhms  [RES 0603_1608]
R64  10 kOhms  [RES 0603_1608]
R65  10 kOhms  [RES 0603_1608]
R66  10 kOhms  [RES 0603_1608]
R67  10 kOhms  [RES 0603_1608]
R68  10 kOhms  [RES 0603_1608]
R69  10 kOhms  [RES 0603_1608]
R70  10 kOhms  [PTC 0402_1005]  (value not drawn)
R71  10 kOhms  [PTC 0402_1005]  (value not drawn)
R72  10 kOhms  [PTC 0402_1005]  (value not drawn)
R132  680 Ohms  [RES 0603_1608]
R133  680 Ohms  [RES 0603_1608]
R134  680 Ohms  [RES 0603_1608]
U8  SCH - DATA ACQUISITION - ADC - TI ADS1231  Supplier Part Number 1: 296-43578-1-ND  [PCB - LEADS - SOIC - TI 16-SOIC]
U9  TMP117AIDRVR  [FP-DRV0006A-MFG]
U10  SCH - SENSOR - IMU - ICM-20948  Supplier Part Number 1: 1428-1123-1-ND  [PCB - LEADLESS - QFN - TDK 24-TFQFN]
U11  PCA9306IDCURQ1  [DCU0008A_M]
U12  SCH - SENSOR - PRESSURE - BMP388  Supplier Part Number 1: 828-1079-1-ND  [PCB - LEADLESS - BOSCH LGA10]
U18  SCH - DATA ACQUISITION - ADC - TI TLA2024  Supplier Part Number 1: 296-48346-1-ND  [PCB - LEADLESS - QFN - TI X2QFN-10]

### Ports
BMP_INTERRUPT (out, see 4[6B]), I2C1_SCL_1V8 (out, see 5[6B], 5[7C]), I2C1_SCL_1V8 (see 5[3B], 5[6B]), I2C1_SCL_1V8 (see 5[3B], 5[7C]), I2C1_SCL_3V3 (see 4[7C], 5[2B], 5[3C], 6[5C], 6[5D], 7[5C]), I2C1_SCL_3V3 (see 4[7C], 5[2B], 5[6A], 6[5C], 6[5D], 7[5C]), I2C1_SCL_3V3 (see 4[7C], 5[3C], 5[6A], 6[5C], 6[5D], 7[5C]), I2C1_SDA_1V8 (bidir, see 5[6B], 5[7C]), I2C1_SDA_1V8 (see 5[3B], 5[6B]), I2C1_SDA_1V8 (see 5[3B], 5[7C]), I2C1_SDA_3V3 (see 4[7C], 5[2B], 5[3C], 6[5C], 6[5D], 7[5C]), I2C1_SDA_3V3 (see 4[7C], 5[2B], 5[6A], 6[5C], 6[5D], 7[5C]), I2C1_SDA_3V3 (see 4[7C], 5[3C], 5[6A], 6[5C], 6[5D], 7[5C]), IMU_INTERRUPT (out, see 4[6B]), LoadAmpClockIn (see 4[3C]), LoadCell+ (see 1[7B]), LoadCell- (see 1[7B]), LoadCell_GND (see 1[6B]), LoadCell_V+ (see 1[6B]), LoadCellData (out, see 4[6B]), LoadCellDataCLK (in, see 4[6B]), LoadCellPWRCtrl (in, see 4[6B]), TEMP_ALERT (out, see 4[6B]), Thermistor1 (out, see 5[1C]), Thermistor2 (out, see 5[1D]), Thermistor2 (out, see 5[2C]), Thermistor3 (out, see 5[1D]), Thermistor3 (out, see 5[2C])

### Nets
+1.8: C55.2 C56.2 C58.2 C59.2 R62.2 R63.2 R69.1 U10.8(VDDIO) U10.13(VDD) U10.22(nCS) U11.2(VREF1) U12.1(VDDIO) U12.10(VDD)
+3.3: C15.2 C51.2 C52.2 C53.2 R56.2 R61.2 R66.2 R67.2 R68.2 U8.1(DVDD) U8.10(VREFP) U8.13(AVDD) U9.5(V+) U18.8(VDD) ; port LoadCell_V+
GND: C15.1 C29.1 C51.1 C52.1 C53.1 C54.1 C55.1 C56.1 C57.1 C58.1 C59.1 C85.1 C86.1 R58.1 R59.1 R60.1 R64.2 R65.2 R70.1 R71.1 R72.1 U8.2(GND) U8.11(GND) U9.2(GND) U9.7(EP) U10.18(GND) U10.20(RESV) U11.1(GND) U12.3(VSS) U12.5(SDO) U12.8(VSS) U12.9(VSS) U18.1(ADDR) U18.3(GND)
NetC29_2: C29.2 R132.2 U18.4(AIN0)
NetC50_1: C50.1 U8.5(CAP)
NetC50_2: C50.2 U8.6(CAP)
NetC54_2: C54.2 R61.1 U11.7(VREF2) U11.8(EN)
NetC57_2: C57.2 U10.10(REGOUT)
NetC85_2: C85.2 R133.2 U18.5(AIN1)
NetC86_2: C86.2 R134.2 U18.6(AIN2)
NetJ7_1: U8.9(VREFN) U8.12(SW) ; port LoadCell_GND
NetJ7_2: U8.8(AIN_N) ; port LoadCell-
NetJ7_3: U8.7(AIN_P) ; port LoadCell+
NetR29_1: U9.1(SCL) U11.6(SCL2) U18.10(SCL) ; port I2C1_SCL_3V3
NetR30_1: U9.6(SDA) U11.5(SDA2) U18.9(SDA) ; port I2C1_SDA_3V3
NetR56_1: R56.1 R58.2 U8.4(SPEED)
NetR57_1: R57.1 R59.2 U8.3(CLKIN)
NetR57_2: R57.2 ; port LoadAmpClockIn
NetR60_2: R60.2 U9.4(ADD0)
NetR62_1: R62.1 U10.23(SCL/SCLK) U11.3(SCL1) U12.2(SCK) ; port I2C1_SCL_1V8
NetR63_1: R63.1 U10.24(SDA/SDI) U11.4(SDA1) U12.4(SDI) ; port I2C1_SDA_1V8
NetR64_1: R64.1 U10.11(FSYNC)
NetR65_1: R65.1 U10.9(AD0/SDO)
NetR66_1: R66.1 R70.2 R132.1 ; port Thermistor1
NetR67_1: R67.1 R71.2 R133.1 ; port Thermistor2
NetR68_1: R68.1 R72.2 R134.1 ; port Thermistor3
NetR69_2: R69.2 U12.6(CSB)
NetU1_44: U12.7(INT) ; port BMP_INTERRUPT
NetU1_45: U9.3(ALERT) ; port TEMP_ALERT
NetU1_46: U10.12(INT1) ; port IMU_INTERRUPT
NetU1_55: U8.14(~{PDWN}) ; port LoadCellPWRCtrl
NetU1_56: U8.15(SCLK) ; port LoadCellDataCLK
NetU1_57: U8.16(~{DRDY}/DOUT) ; port LoadCellData

Not connected (* = marked no-connect by the designer): U10 1(NC)* 2(NC)* 3(NC)* 4(NC)* 5(NC)* 6(NC)* 7(AUX_CL)* 14(NC)* 15(NC)* 16(NC)* 17(NC)* 19(RESV)* 21(AUX_DA)*; U18 2(NC)* 7(AIN3)*

### Notes on the sheet
- (near U9) i2c address: b1001000
- DNP high/low Resistor based on SPEED
- (near R59) DNP 10K/0 Resistor based on CLK input
- (near U10) i2c address: b1101000
- (near R69) i2c address: b1110110
- Sample all three thermistors in 25ms
  Sample rate per channel is 8.33ms (120Hz)
  Set ADC to 920Hz (410Hz Nyquist)
  Filtering is configured for 500Hz
- 500Hz RC filter
- Title
- Size:
- Date:
- A3
- Number:
- Time:
- Revision:
- Sheet
- of
- File:

### Library data of the parts
C15 C50-C59 = CL10B104KA8WPNC: as C14 on sheet Microcontroller; Part Number: CL10B104KA8WPNC; Value: 0.1µF; Applications: Automotive; Capacitance: 0.1µF; ComponentLink1Description: Datasheet; ComponentLink1URL: http://www.samsungsem.com/kr/support/product-search/mlcc/CL10B104KA8WPNC.jsp; ComponentLink2Description: DigiKey Link; ComponentLink2URL: http://digikey.com/product-detail/en/samsung-electro-mechanics/CL10B104KA8WPNC/1276-6717-1-ND/5961576; Device Package: 0603 (1608 Metric); Features: Open Mode; LastUpdated: 9/2/2020 1:03:30 AM; Lifecycle Status: Active; Minimum Order: 1; Mounting Type: Surface Mount, MLCC; Operating Temperature: -55°C ~ 125°C; Package / Case: 0603 (1608 Metric); Packaging: TapeAndReel; PartId: 5631; Part Status: Active; Price: 0.02; Ratings: AEC-Q200; Series: CL; Size / Dimension: 0.063" L x 0.031" W (1.60mm x 0.80mm); Supplier 1: DigiKey; Supplier Part Number 1: 1276-6717-1-ND; Temperature Coefficient: X7R; Thickness (Max): 0.035" (0.90mm); Voltage - Rated: 25V
C29 C85 C86 = C0603C474K4PACTU: CAP CER 0.47UF 16V X5R 0603; Manufacturer: KEMET; Tolerance: ±10%; Part Number: C0603C474K4PACTU; Value: 0.47µF; Applications: General Purpose; Capacitance: 0.47µF; ComponentLink1Description: Datasheet; ComponentLink1URL: https://api.kemet.com/component-edge/download/datasheet/C0603C474K4PACTU.pdf; ComponentLink2Description: DigiKey Link; ComponentLink2URL: http://digikey.com/product-detail/en/kemet/C0603C474K4PACTU/399-7934-1-ND/3471657; Device Package: 0603 (1608 Metric); LastUpdated: 9/2/2020 1:03:36 AM; Lifecycle Status: Active; Minimum Order: 1; Mounting Type: Surface Mount, MLCC; Operating Temperature: -55°C ~ 85°C; Package / Case: 0603 (1608 Metric); Packaging: TapeAndReel; PartId: 2292; Part Status: Active; Price: 0.02; Series: SMD Comm X5R; Size / Dimension: 0.063" L x 0.031" W (1.60mm x 0.80mm); Supplier 1: DigiKey; Supplier Part Number 1: 399-7934-1-ND; Temperature Coefficient: X5R; Thickness (Max): 0.034" (0.87mm); Voltage - Rated: 16V
R56 R58-R60 R64 R65 R69 = RMCF0603JT10K0: as R1 on sheet Controllers; Part Number: RMCF0603JT10K0; Value: 10 kOhms; ComponentLink1Description: Datasheet; ComponentLink1URL: https://www.seielect.com/catalog/sei-packaging.pdf; ComponentLink2Description: DigiKey Link; ComponentLink2URL: http://digikey.com/product-detail/en/stackpole-electronics-inc/RMCF0603JT10K0/RMCF0603JT10K0CT-ND/1943191; Composition: Thick Film; Device Package: 0603 (1608 Metric); Features: Automotive AEC-Q200; Height - Seated (Max): 0.022" (0.55mm); LastUpdated: 8/30/2020 8:48:45 PM; Lifecycle Status: Active; Minimum Order: 1; Number of Terminations: 2; Operating Temperature: -55°C ~ 155°C; Package / Case: 0603 (1608 Metric); Packaging: CutTape; PartId: 25659; Part Status: Active; Price: 0.10; Ratings: AEC-Q200; Resistance: 10 kOhms; Series: RMCF; Size / Dimension: 0.061" L x 0.031" W (1.55mm x 0.80mm); Supplier 1: DigiKey; Supplier Part Number 1: RMCF0603JT10K0CT-ND; Supplier Device Package: 0603; Tolerance: ±5%
R57 = RMCF0603ZT0R00: RES 0 OHM JUMPER 1/10W 0603; Manufacturer: Stackpole Electronics Inc; Power (Watts): 0.1W, 1/10W; Part Number: RMCF0603ZT0R00; Value: 0 Ohms; ComponentLink1Description: Datasheet; ComponentLink1URL: https://www.seielect.com/catalog/sei-rmcf_rmcp.pdf; ComponentLink2Description: DigiKey Link; ComponentLink2URL: http://digikey.com/product-detail/en/stackpole-electronics-inc/RMCF0603ZT0R00/RMCF0603ZT0R00CT-ND/1943218; Composition: Thick Film; Device Package: 0603 (1608 Metric); Features: Automotive AEC-Q200; Height - Seated (Max): 0.022" (0.55mm); LastUpdated: 9/2/2020 1:09:45 AM; Lifecycle Status: Active; Minimum Order: 1; Number of Terminations: 2; Operating Temperature: -55°C ~ 155°C; Package / Case: 0603 (1608 Metric); Packaging: CutTape; PartId: 22613; Part Status: Active; Price: 0.10; Ratings: AEC-Q200; Resistance: 0 Ohms; Series: RMCF; Size / Dimension: 0.061" L x 0.031" W (1.55mm x 0.80mm); Supplier 1: DigiKey; Supplier Part Number 1: RMCF0603ZT0R00CT-ND; Supplier Device Package: 0603; Tolerance: Jumper
R61 = RMCF0603FT200K: RES 200K OHM 1% 1/10W 0603; Manufacturer: Stackpole Electronics Inc; Power (Watts): 0.1W, 1/10W; Temperature Coefficient: ±100ppm/°C; Part Number: RMCF0603FT200K; Value: 200 kOhms; ComponentLink1Description: Datasheet; ComponentLink1URL: https://www.seielect.com/catalog/sei-rmcf_rmcp.pdf; ComponentLink2Description: DigiKey Link; ComponentLink2URL: http://digikey.com/product-detail/en/stackpole-electronics-inc/RMCF0603FT200K/RMCF0603FT200KCT-ND/1943126; Composition: Thick Film; Device Package: 0603 (1608 Metric); Features: Automotive AEC-Q200; Height - Seated (Max): 0.022" (0.55mm); LastUpdated: 9/2/2020 1:10:13 AM; Lifecycle Status: Active; Minimum Order: 1; Number of Terminations: 2; Operating Temperature: -55°C ~ 155°C; Package / Case: 0603 (1608 Metric); Packaging: CutTape; PartId: 10646; Part Status: Active; Price: 0.10; Ratings: AEC-Q200; Resistance: 200 kOhms; Series: RMCF; Size / Dimension: 0.061" L x 0.031" W (1.55mm x 0.80mm); Supplier 1: DigiKey; Supplier Part Number 1: RMCF0603FT200KCT-ND; Supplier Device Package: 0603; Tolerance: ±1%
R62 R63 = RMCF0603FT4K70: as R29 on sheet Microcontroller; Part Number: RMCF0603FT4K70; Value: 4.7 kOhms; ComponentLink1Description: Datasheet; ComponentLink1URL: https://www.seielect.com/catalog/sei-rmcf_rmcp.pdf; ComponentLink2Description: DigiKey Link; ComponentLink2URL: http://digikey.com/product-detail/en/stackpole-electronics-inc/RMCF0603FT4K70/RMCF0603FT4K70CT-ND/1943033; Composition: Thick Film; Device Package: 0603 (1608 Metric); Features: Automotive AEC-Q200; Height - Seated (Max): 0.022" (0.55mm); LastUpdated: 9/2/2020 1:10:22 AM; Lifecycle Status: Active; Minimum Order: 1; Number of Terminations: 2; Operating Temperature: -55°C ~ 155°C; Package / Case: 0603 (1608 Metric); Packaging: CutTape; PartId: 6078; Part Status: Active; Price: 0.10; Ratings: AEC-Q200; Resistance: 4.7 kOhms; Series: RMCF; Size / Dimension: 0.061" L x 0.031" W (1.55mm x 0.80mm); Supplier 1: DigiKey; Supplier Part Number 1: RMCF0603FT4K70CT-ND; Supplier Device Package: 0603; Tolerance: ±1%
R66-R68 = RMCF0603FT10K0: RES 10K OHM 1% 1/10W 0603; Manufacturer: Stackpole Electronics Inc; Power (Watts): 0.1W, 1/10W; Temperature Coefficient: ±100ppm/°C; Part Number: RMCF0603FT10K0; Value: 10 kOhms; ComponentLink1Description: Datasheet; ComponentLink1URL: https://www.seielect.com/catalog/sei-rmcf_rmcp.pdf; ComponentLink2Description: DigiKey Link; ComponentLink2URL: http://digikey.com/product-detail/en/stackpole-electronics-inc/RMCF0603FT10K0/RMCF0603FT10K0CT-ND/1943057; Composition: Thick Film; Device Package: 0603 (1608 Metric); Features: Automotive AEC-Q200; Height - Seated (Max): 0.022" (0.55mm); LastUpdated: 9/2/2020 1:09:31 AM; Lifecycle Status: Active; Minimum Order: 1; Number of Terminations: 2; Operating Temperature: -55°C ~ 155°C; Package / Case: 0603 (1608 Metric); Packaging: CutTape; PartId: 25663; Part Status: Active; Price: 0.10; Ratings: AEC-Q200; Resistance: 10 kOhms; Series: RMCF; Size / Dimension: 0.061" L x 0.031" W (1.55mm x 0.80mm); Supplier 1: DigiKey; Supplier Part Number 1: RMCF0603FT10K0CT-ND; Supplier Device Package: 0603; Tolerance: ±1%
R70-R72 = TMP6131DECR: SENSOR PTC 10KOHM 1% X1SON; Manufacturer: Texas Instruments; ComponentLink1Description: Datasheet; ComponentLink1URL: http://www.ti.com/general/docs/suppproductinfo.tsp?distId=10&gotoUrl=http%3A%2F%2Fwww.ti.com%2Flit%2Fgpn%2Ftmp61; ComponentLink2Description: DigiKey Link; ComponentLink2URL: http://digikey.com/product-detail/en/texas-instruments/TMP6131DECR/296-TMP6131DECRCT-ND/10435285; Device Package: 0402 (1006 Metric); LastUpdated: 9/2/2020 1:30:57 AM; Lifecycle Status: Active; Part Number: TMP6131DECR; Minimum Order: 1; Mounting Type: Surface Mount; Operating Temperature: -40°C ~ 125°C (TA); Package / Case: 0402 (1006 Metric); Packaging: TapeAndReel; Part Status: Active; Price: 0.07; Resistance @ 25°C: 10 kOhms; Resistance Tolerance: ±1%; Series: Commercial; Supplier 1: DigiKey; Supplier Part Number 1: 296-TMP6131DECRCT-ND; Supplier Device Package: 2-X1SON (1x.60); Value: 10 kOhms
R132-R134 = RMCF0603FT680R: RES 680 OHM 1% 1/10W 0603; Manufacturer: Stackpole Electronics Inc; Power (Watts): 0.1W, 1/10W; Temperature Coefficient: ±100ppm/°C; Part Number: RMCF0603FT680R; Value: 680 Ohms; ComponentLink1Description: Datasheet; ComponentLink1URL: https://www.seielect.com/catalog/sei-packaging.pdf; ComponentLink2Description: DigiKey Link; ComponentLink2URL: http://digikey.com/product-detail/en/stackpole-electronics-inc/RMCF0603FT680R/RMCF0603FT680RCT-ND/6053170; Composition: Thick Film; Device Package: 0603 (1608 Metric); Features: Automotive AEC-Q200; Height - Seated (Max): 0.022" (0.55mm); LastUpdated: 9/2/2020 1:10:13 AM; Lifecycle Status: Active; Minimum Order: 1; Number of Terminations: 2; Operating Temperature: -55°C ~ 155°C; Package / Case: 0603 (1608 Metric); Packaging: CutTape; PartId: 10671; Part Status: Active; Price: 0.10; Ratings: AEC-Q200; Resistance: 680 Ohms; Series: RMCF; Size / Dimension: 0.061" L x 0.031" W (1.55mm x 0.80mm); Supplier 1: DigiKey; Supplier Part Number 1: RMCF0603FT680RCT-ND; Supplier Device Package: 0603; Tolerance: ±1%
U9 = CMP-04948-000009-1: TEMPERATURE SENSOR; Manufacturer: Texas Instruments; Operating Supply Current: 3.5-16uA; Standoff Height: 0mm; Min Supply Voltage: 1.8V; Resolution: 16bits; Interface: I2C,2-Wire,SMBus; Max Junction Temp: +150°C; Max Supply Voltage: 5.5V; Octopart: https://octopart.com/tmp117aidrvr-texas+instruments-95511044; Lead Free: Yes; ComponentLink2Description: Datasheet; Temperature Range High: +150°C; Manufacturer Part Number: TMP117AIDRVR; Ambient Temperature Range High: +150°C; Ambient Temperature Range Low: -55°C; Height: 0.8mm; ComponentLink2URL: http://www.ti.com/lit/ds/symlink/tmp117.pdf; Automotive: No; Device Class L1: Sensors; RoHS: TRUE; Package: DRV0006A; Device Class L3: unset; Temperature: -55°C to +150°C; Temperature Range Low: -55°C; Ipc Land Pattern Name: DFN200X200X80-6; Device Class L2: Temperature and Humidity Sensors; Category: IC; Digikey Description: TEMPERATURE SENSOR
U11 = CMP-0314-00424-2: Automotive Catalog Dual Bidirectional I2C Bus and SMBus Voltage-Level Translator, 0 to 5.5 V,-40 to 85 degC,8-pin US8 (DCU), Green (RoHS & no Sb/Br); Manufacturer: Texas Instruments; fSCLK(Max)(MHz): 400; Vcc range(V): 0 to 5.5; 5V Tolerant I/O: Yes; tpd max(ns): 1.4; Function: Voltage Translator; SubFamily: I2C Special Function; No. of Outputs: 2; Mounting Technology: Surface Mount; ComponentLink1Description: Datasheet; ComponentLink2Description: Package Specification; PackageReference: DCU0008A; Rating: Automotive; PackageVersion: revF, Jul-2005; Eco-Plan: Green (RoHS & no Sb/Br); ComponentLink2URL: http://www.ti.com/litv/pdf/mpds050d; Max Frequency(kHz): 400; Open Drain I/O Type: Yes; On-Chip Power-on-Reset: No; PartNumber: PCA9306IDCURQ1; Code_JEDEC: MO-187-CA; DatasheetVersion: SCPS178; PackageDescription: 8-Pin Thin Shrink Small Outline Package 0.5 mm Pitch; ComponentLink1URL: http://www.ti.com/general/docs/lit/getliterature.tsp?genericPartNumber=PCA9306-Q1&fileType=pdf; Enable Pin: Yes
U8 = SCH - DATA ACQUISITION - ADC - TI ADS1231: Supplier 1: Digi-Key
U10 = SCH - SENSOR - IMU - ICM-20948: Supplier 1: Digi-Key
U12 = SCH - SENSOR - PRESSURE - BMP388: Supplier 1: Digi-Key
U18 = SCH - DATA ACQUISITION - ADC - TI TLA2024: Supplier 1: Digi-Key